# Altium schematic sheet MCU.SchDoc
size A; SheetNumber: 3; SheetTotal: 3
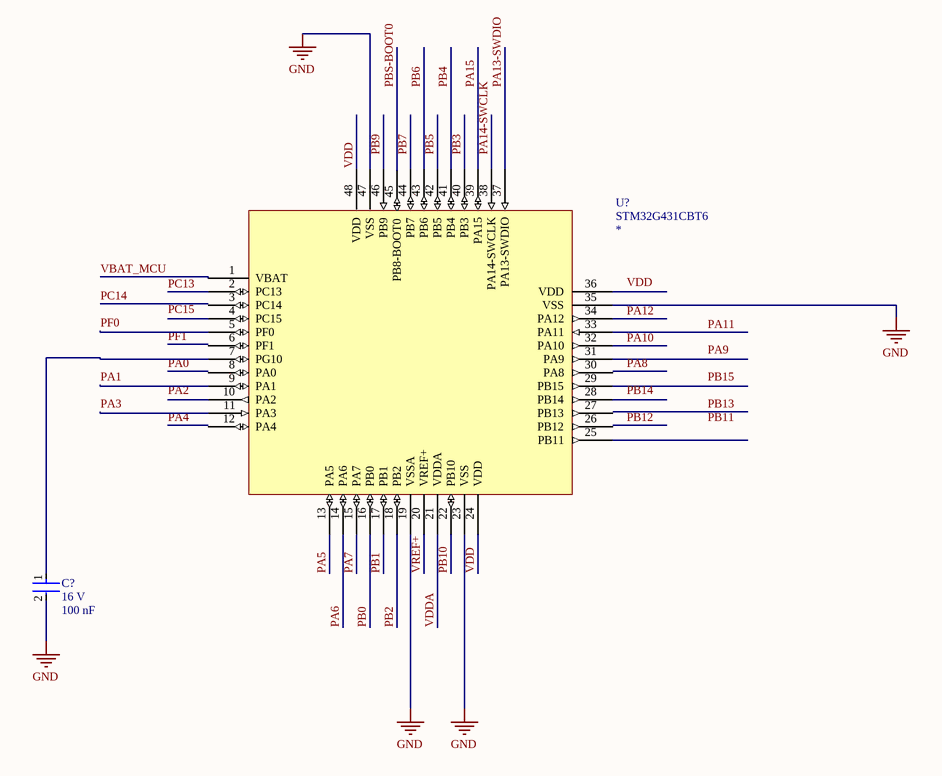
[diagram p0: MCU.SchDoc]

## Parts
C?  Voltage Rating: 16 V  Capacitance: 100 nF  [CAP-0402]  (hidden comment: CC0402KRX7R7BB104)
U?  STM32G431CBT6  [LQFP48-7x7mm]

## Nets
GND: C?.2 U?.19(VSSA) U?.23(VSS) U?.35(VSS) U?.47(VSS)
PA1: U?.9(PA1)
PA3: U?.11(PA3)
PA5: U?.13(PA5)
PA6: U?.14(PA6)
PA7: U?.15(PA7)
PA10: U?.32(PA10)
PA11: U?.33(PA11)
PA12: U?.34(PA12)
PA13-SWDIO: U?.37(PA13-SWDIO)
PA14-SWCLK: U?.38(PA14-SWCLK)
PA15: U?.39(PA15)
PB0: U?.16(PB0)
PB1: U?.17(PB1)
PB2: U?.18(PB2)
PB3: U?.40(PB3)
PB4: U?.41(PB4)
PB5: U?.42(PB5)
PB6: U?.43(PB6)
PB7: U?.44(PB7)
PB9: U?.46(PB9)
PB10: U?.22(PB10)
PBS-BOOT0: U?.45(PB8-BOOT0)
PC13: U?.2(PC13)
PF0: U?.5(PF0)
VBAT_MCU: U?.1(VBAT)
VDD: U?.24(VDD) U?.48(VDD)
VDDA: U?.21(VDDA)
VREF+: U?.20(VREF+)
NetC?_1: C?.1 U?.7(PG10)

Not connected (* = marked no-connect by the designer): U? 3(PC14) 4(PC15) 6(PF1) 8(PA0) 10(PA2) 12(PA4) 25(PB11) 26(PB12) 27(PB13) 28(PB14) 29(PB15) 30(PA8) 31(PA9) 36(VDD)

## Notes on the sheet
- Labels drawn without touching a wire or pin: PA2, PA9, PB11, PB14, PB15, PC15, VDD

## Library data of the parts
C? = CAP-0.1U-0001: CAP CER 0.1UF 16V X7R 0402; ComponentLink2Description: Datasheet; ComponentLink2URL: https://www.yageo.com/upload/media/product/productsearch/datasheet/mlcc/UPY-GPHC_X7R_6.3V-to-250V_24.pdf; Device Class: Ceramic; Size: 0402
U? = IC-STM32G431CBT6: ARM® Cortex®-M4F STM32G4 Microcontroller IC 32-Bit Single-Core 170MHz 128KB (128K x 8) FLASH 48-LQFP (7x7); Parameter 1: *